# Altium schematic sheet connectors.SchDoc
size A4
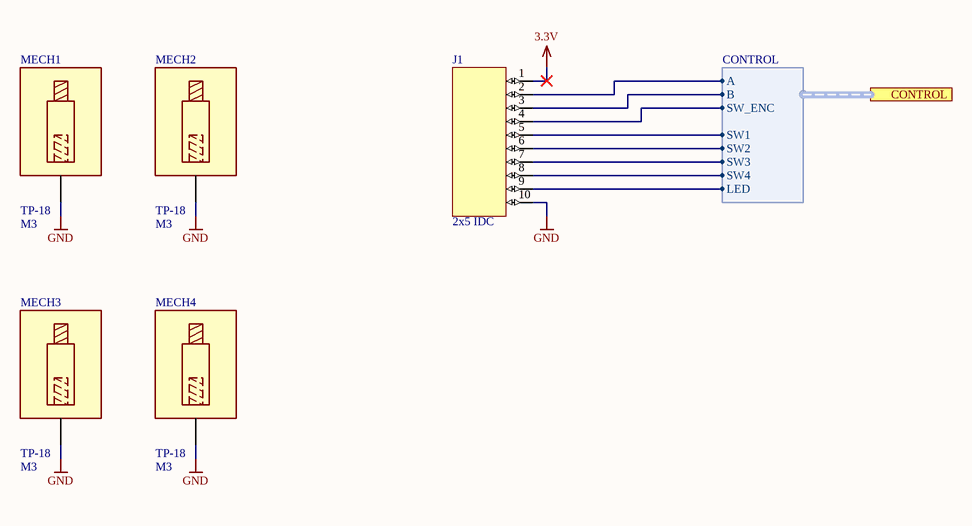
[diagram p0: connectors.SchDoc]

## Parts
J1  2x5 IDC  [IDC_2x5]
MECH1  value TP-18  SCH_Footprint: M3  [MECH_SPACER_MALE_FEMALE_18MM_M3]  (hidden comment: M3X0.5)
MECH2  value TP-18  SCH_Footprint: M3  [MECH_SPACER_MALE_FEMALE_18MM_M3]  (hidden comment: M3X0.5)
MECH3  value TP-18  SCH_Footprint: M3  [MECH_SPACER_MALE_FEMALE_18MM_M3]  (hidden comment: M3X0.5)
MECH4  value TP-18  SCH_Footprint: M3  [MECH_SPACER_MALE_FEMALE_18MM_M3]  (hidden comment: M3X0.5)

## Ports
CONTROL (harness CONTROL)

## Harnesses
CONTROL: A, B, SW_ENC, SW1, SW2, SW3, SW4, LED

## Nets
3.3V: J1.1
GND: J1.10 MECH1.1 MECH2.1 MECH3.1 MECH4.1
NetJ1_2: J1.2 ; port CONTROL.A
NetJ1_3: J1.3 ; port CONTROL.B
NetJ1_4: J1.4 ; port CONTROL.SW_ENC
NetJ1_5: J1.5 ; port CONTROL.SW1
NetJ1_6: J1.6 ; port CONTROL.SW2
NetJ1_7: J1.7 ; port CONTROL.SW3
NetJ1_8: J1.8 ; port CONTROL.SW4
NetJ1_9: J1.9 ; port CONTROL.LED

## Library data of the parts
J1 = IDC_2x5: 2x5 IDC Header
MECH1-MECH4 = MECH_SPACER_MALE_FEMALE_18MM_M3: Manufacturer: FIX&FASTEN; Part Number: MECH_SPACER_MALE_FEMALE_18MM_M3; HelpURL: http://www.tme.eu/pl/Document/c63f116060195082d899531b8f30ddf7/TP-10.pdf; Manufacturer Part Number: TP-18; Supplier 1: TME; Supplier Part Number 1: TP-18; Supplier 2: RS Components; Supplier 3: Farnell; Supplier 4: Mouser; Supplier 5: Digi-Key